# Altium project Tcc-Estacao solarimetrica.PrjPcb
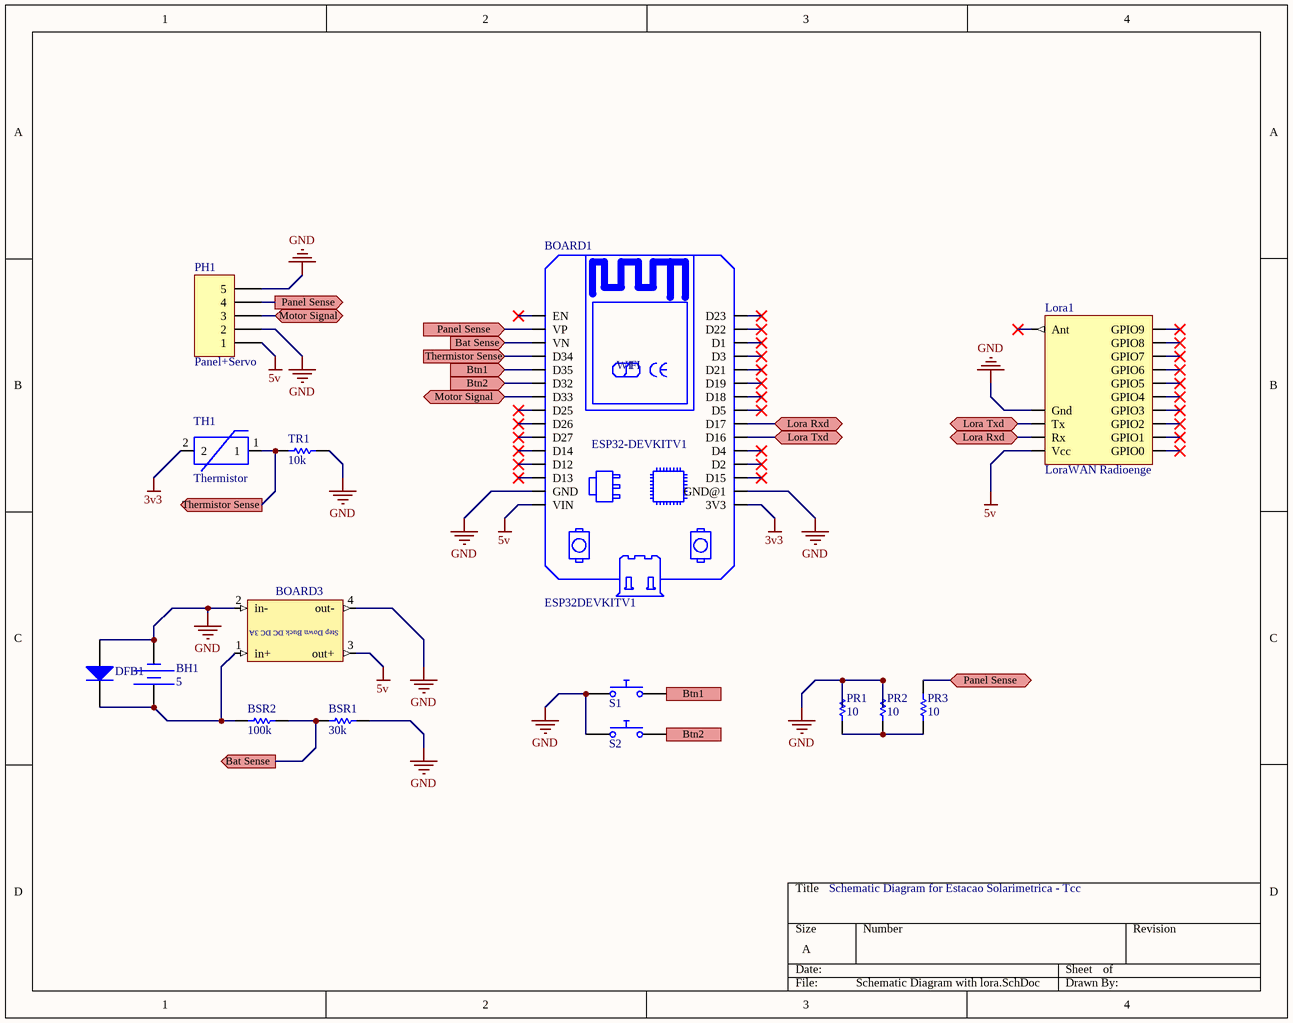
[diagram p0: Schematic Diagram with lora.SchDoc]
1 sheet, 15 parts. Net scope: flat (ports and power ports of the same name join across sheets).
Board files: PcbLayout with radioenge.PcbDoc, Pcb Layout with lora.PcbDoc

## Sheet Schematic Diagram with lora.SchDoc: Schematic Diagram for Estacao Solarimetrica - Tcc
size A; Author: Matheus Wintruff; CompanyName: Otoma Systems; DrawnBy: Matheus Wintruff; DocumentNumber: 1; Revision: 2.1.0; SheetNumber: 1; SheetTotal: 1

### Parts
BH1  DC Magnitude: 5  [HDR1X2]  (hidden comment: Constant Voltage Source)
BOARD1  ESP32DEVKITV1  [ESP32-DEVKITV1]
BOARD3  Step Down Buck DC DC 3A  [Step Down Buck DC DC 3A]  (value not drawn)
BSR1  value 30k  [Smd Resistor]  (hidden comment: Resistor_1)
BSR2  value 100k  [Smd Resistor]
DFB1  (no value)  [Smd Thermistor Terminal]
Lora1  LoraWAN Radioenge  [LORAMESH]
PH1  Panel+Servo  [HDR1X5]
PR1  value 10  [1/4W SMD Resistor]
PR2  value 10  [1/4W SMD Resistor]
PR3  value 10  [1/4W SMD Resistor]
S1  Push Button Normally Opened  [Smd Push Button (Extended Legs)]  (value not drawn)
S2  Push Button Normally Opened  [Smd Push Button (Extended Legs)]  (value not drawn)
TH1  Thermistor  [Smd Thermistor Terminal]
TR1  value 10k  [Smd Resistor]  (hidden comment: Resistor_3)

### Ports
Bat Sense (in), Bat Sense (out), Btn1 (in), Btn1 (out), Btn2 (in), Btn2 (out), Lora Rxd (bidir), Lora Txd (bidir), Motor Signal (bidir), Panel Sense (bidir), Panel Sense (in), Panel Sense (out), Thermistor Sense (in), Thermistor Sense (out)

### Nets
3v3: BOARD1.3V3 TH1.2
5v: BOARD1.VIN BOARD3.3(out+) Lora1.Vcc PH1.1
GND: BH1.1(-) BOARD1.GND BOARD1.GND@1 BOARD3.2(in-) BOARD3.4(out-) BSR1.1 DFB1.1(A) Lora1.Gnd PH1.2 PH1.5 PR1.1 PR2.1 S1.1 S2.1 TR1.1
NetBH1_2: BH1.2(+) BOARD3.1(in+) BSR2.2 DFB1.2(K)
NetBOARD1_D16: BOARD1.D16 Lora1.3(Tx) ; port Lora Txd
NetBOARD1_D17: BOARD1.D17 Lora1.2(Rx) ; port Lora Rxd
NetBOARD1_D32: BOARD1.D32 S2.2 ; port Btn2
NetBOARD1_D33: BOARD1.D33 PH1.3 ; port Motor Signal
NetBOARD1_D34: BOARD1.D34 TH1.1 TR1.2 ; port Thermistor Sense
NetBOARD1_D35: BOARD1.D35 S1.2 ; port Btn1
NetBOARD1_VN: BOARD1.VN BSR1.2 BSR2.1 ; port Bat Sense
NetBOARD1_VP: BOARD1.VP PH1.4 PR3.1 ; port Panel Sense
NetPR1_2: PR1.2 PR2.2 PR3.2

Not connected (* = marked no-connect by the designer): BOARD1 D1* D2* D3* D4* D5* D12* D13* D14* D15* D18* D19* D21* D22* D23* D25* D26* D27* EN*; Lora1 6(GPIO0)* 7(GPIO1)* 9(GPIO2)* 10(GPIO3)* 11(GPIO4)* 12(GPIO5)* 13(GPIO6)* 14(GPIO7)* 15(GPIO8)* 16(GPIO9)* 18(Ant)*

### Notes on the sheet
- (in symbol ESP32DEVKITV1) WI; FI; ESP32-DEVKITV1

### Library data of the parts
BH1 = Battery: SimulationGenericComponent: True
BOARD1 = ESP32DEVKITV1: Dual core, Wi-Fi: 2.4 GHz up to 150 Mbits/s,BLE (Bluetooth Low Energy) and legacy Bluetooth, 32 bits, Up to 240 MHz; MF: Do it; SnapEDA_Link: https://www.snapeda.com/parts/ESP32%20DEVKIT%20V1/Do%20it/view-part/5659245/?ref=snap; Price: None; MP: ESP32 DEVKIT V1; Check_prices: https://www.snapeda.com/parts/ESP32%20DEVKIT%20V1/Do%20it/view-part/5659245/?ref=eda; Availability: Unavailable; Value: *; Package: Package
BSR1 = Resistor_1: Resistor; TC1: 0; SimulationGenericComponent: True; TC2: 0
BSR2 = Resistor_2: Resistor; TC1: 0; SimulationGenericComponent: True; TC2: 0
DFB1 = Diode: AF: 1; BV: 0; BV_MAX: 1e99; EG: 1.11; FC: 0.5; IBV: 0.001; ISR: 1e-14; MJSW: 0.33; NTUN: 30; TNOM: 27; XTI: 3; SimulationGenericComponent: True; CJO: 0; CJP: 0; CTA: 0; CTP: 0; FCS: 0.5; FV_MAX: 1e99; IKF: 0; IKR: 0; JSW: 0; JTUN: 0; JTUNSW: 0; KEG: 1; KF: 0; LEVEL: 1; N: 1; NBV: 1; NR: 1; NS: 1; PHP: 1; RS: 0; TCV: 0; TLEV: 0; TLEVC: 0; TM1: 0; TM2: 0; TPB: 0; TPHP: 0; TRS: 0; TRS2: 0; TT: 0; TTT1: 0; TTT2: 0; VJ: 1; XTITUN: 3; IS: 1e-14
PH1 = Header 5: Header, 5-Pin; LatestRevisionDate: 17-Jul-2002; LatestRevisionNote: Re-released for DXP Platform.; Publisher: Altium Limited
PR1-PR3 = Resistor: TC1: 0; SimulationGenericComponent: True; TC2: 0
S1 S2 = Push Button NO: closed: 0; Rclosed: 1m; Ropen: 1Meg; SimulationGenericComponent: True
TR1 = Resistor_3: Resistor; TC1: 0; SimulationGenericComponent: True; TC2: 0